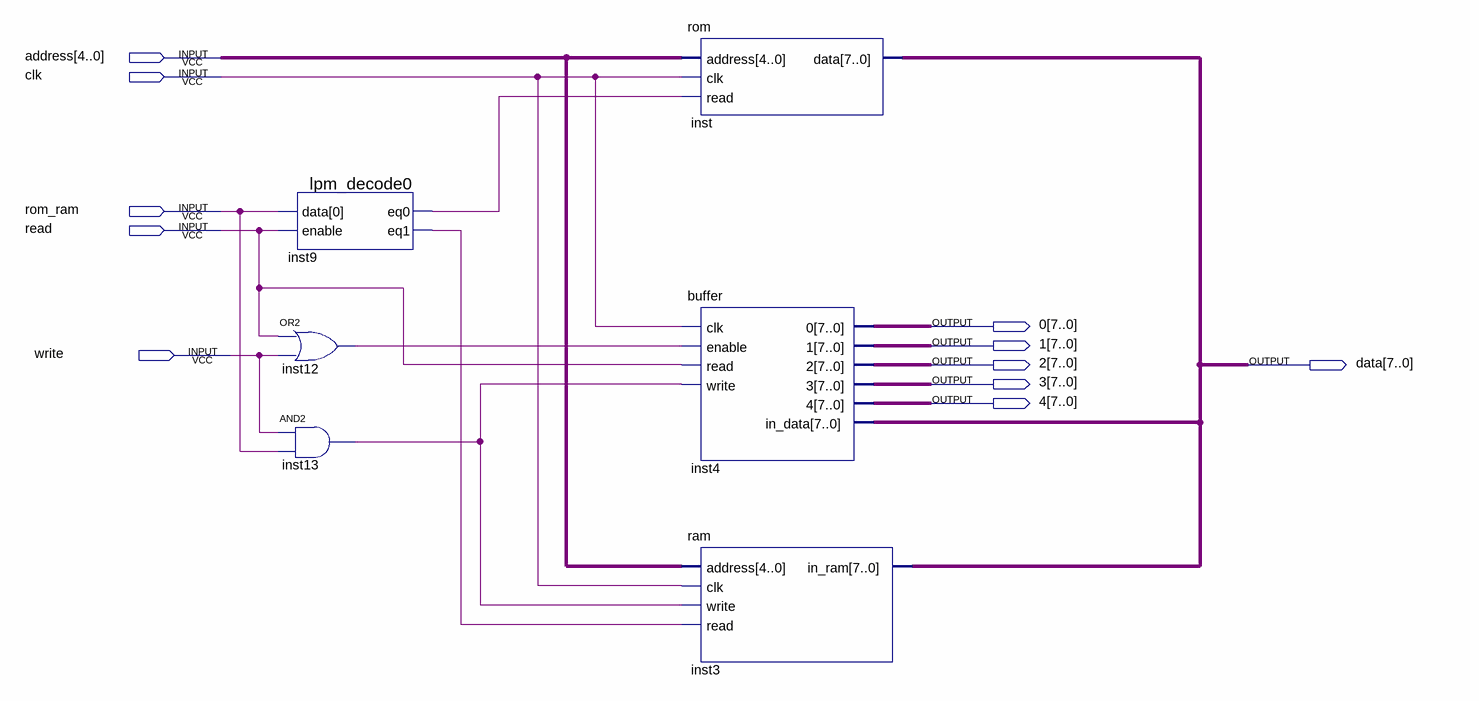
[diagram p0: schematic sheet]
// Quartus schematic main.bdf as structural Verilog: 6 symbols, 11 pins
module main (
  input  [4:0] address,
  input  clk,
  input  rom_ram,
  input  read,
  input  write,
  output [7:0] \0 ,
  output [7:0] \1 ,
  output [7:0] \2 ,
  output [7:0] data,
  output [7:0] \3 ,
  output [7:0] \4 
);

  wire inst9_eq0, inst9_eq1, inst12_out, inst13_out;

  lpm_decode0 inst9 (.data(rom_ram), .enable(read), .eq0(inst9_eq0), .eq1(inst9_eq1));
  or inst12 (inst12_out, read, write);
  and inst13 (inst13_out, write, rom_ram);
  rom inst (.address(address), .clk(clk), .read(inst9_eq0), .data(data));
  buffer inst4 (
    .clk(clk), .enable(inst12_out), .read(read), .write(inst13_out), .\0 (\0 ), .\1 (\1 ), .\2 (\2 ),
    .\3 (\3 ), .\4 (\4 ), .in_data(data));
  ram inst3 (.address(address), .clk(clk), .write(inst13_out), .read(inst9_eq1), .in_ram(data));
endmodule
